# EAGLE design bt-uart (EAGLE 6.1)
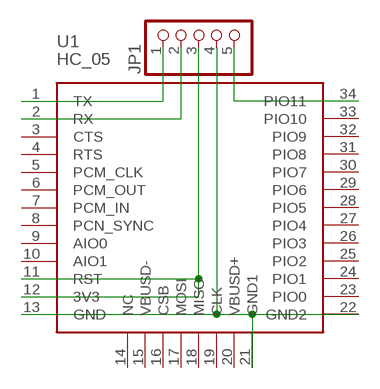
[diagram p0: schematic, sheet 1]

## Parts
JP1  PINHD-1X5  [1X05]
U1  HC_05  [BLUETOOTH_SMD]

## Nets
N$1: JP1.1 U1.1(TX)
N$2: JP1.2 U1.2(RX)
N$3: JP1.5 U1.34(PIO11)
N$4: JP1.3 U1.11(RST) U1.12(3V3)
N$5: JP1.4 U1.13(GND) U1.21(GND1) U1.22(GND2)
Unconnected: U1.3(CTS) U1.4(RTS) U1.5(PCM_CLK) U1.6(PCM_OUT) U1.7(PCM_IN) U1.8(PCN_SYNC) U1.9(AIO0) U1.10(AIO1) U1.14(NC) U1.15(VBUSD-) U1.16(CSB) U1.17(MOSI) U1.18(MISO) U1.19(CLK) U1.20(VBUSD+) U1.23(PIO0) U1.24(PIO1) U1.25(PIO2) U1.26(PIO3) U1.27(PIO4) U1.28(PIO5) U1.29(PIO6) U1.30(PIO7) U1.31(PIO8) U1.32(PIO9) U1.33(PIO10)

## Library data of the parts
JP1 = pinhead:PINHD-1X5: PIN HEADER
U1 = SerialPortBluetooth:HC_05

## Board
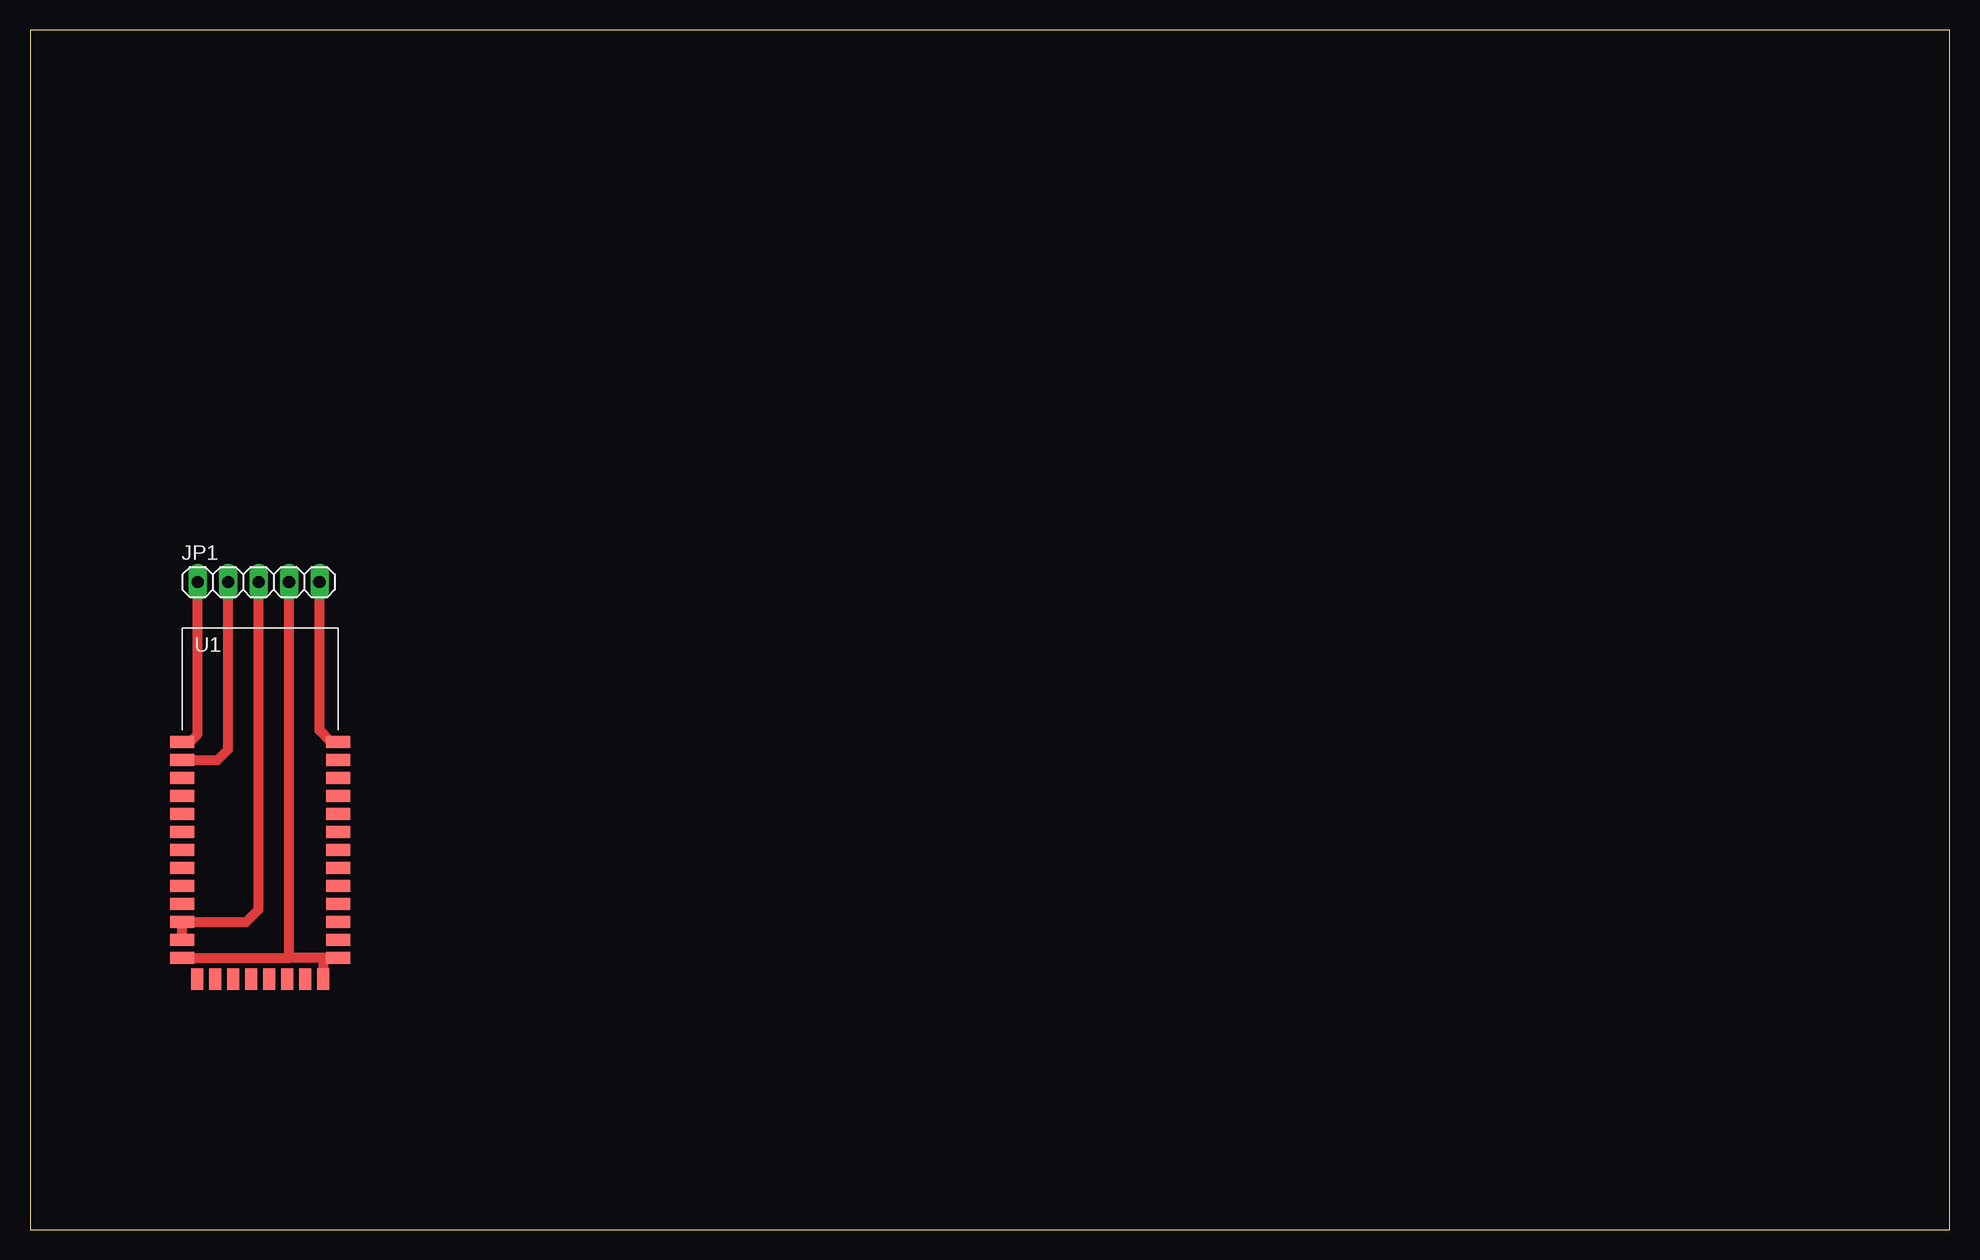
[diagram p1: board, top side]

Size 160 x 100 mm. Coordinates in mm from the lower left corner, seen from the top.
Outline: 0,0 160,0 160,100 0,100 0,0
Copper layers (1*16): Top 0.035mm / dielectric 1.5mm / Bottom 0.035mm
Design rules: minimum track width 10mil, minimum drill 24mil, track to track 12mil, track to pad 12mil, pad to pad 12mil, via to via 12mil, smd to smd 10mil, copper to edge 12mil, drill to drill 12mil, minimum pad ring 10mil, minimum via ring 10mil, stop-mask expansion 4mil, vias tented up to drill 0mil, thermal gap 12mil

### Footprints (pad centres in the part's own frame; a part is rotated, then mirrored left to right if it is on the bottom)
1X05 = drill 1.016 long: 1 -5.08,0; 2 -2.54,0; 3 0,0; 4 2.54,0; 5 5.08,0
BLUETOOTH_SMD = smd 2 x 1: 1 0,0; 2 0,-1.5; 3 0,-3; 4 0,-4.5; 5 0,-6; 6 0,-7.5; 7 0,-9; 8 0,-10.5; 9 0,-12; 10 0,-13.5; 11 0,-15; 12 0,-16.5; 13 0,-18; 22 13,-18; 23 13,-16.5; 24 13,-15; 25 13,-13.5; 26 13,-12; 27 13,-10.5; 28 13,-9; 29 13,-7.5; 30 13,-6; 31 13,-4.5; 32 13,-3; 33 13,-1.5; 34 13,0 | smd 1 x 1.8: 14 1.25,-19.75; 15 2.75,-19.75; 16 4.25,-19.75; 17 5.75,-19.75; 18 7.25,-19.75; 19 8.75,-19.75; 20 10.25,-19.75; 21 11.75,-19.75

### Placement (x,y rotation side)
JP1  19.05,53.98 0 top
U1  12.7,40.64 0 top

### Tracks (layer width: path | path; a pad name or v marks a point on that pad's centre or on a via)
N$1
  Top 0.813: U1.1 13.34,40.64 13.97,41.27 JP1.1
N$2
  Top 0.813: U1.2 15.64,39.14 16.51,40.01 JP1.2
N$3
  Top 0.813: U1.34 25.08,40.64 24.13,41.59 JP1.5
N$4
  Top 0.813: U1.12 U1.11 18.02,25.64 19.05,26.67 JP1.3
N$5  (1 unrouted)
  Top 0.813: U1.13 21.59,22.64 | 24.45,22.64 24.45,20.95 | U1.22 24.45,22.64 | 24.45,22.64 21.59,22.64 | 21.59,22.64 JP1.4